# Altium project WSN_Node.PrjPcb
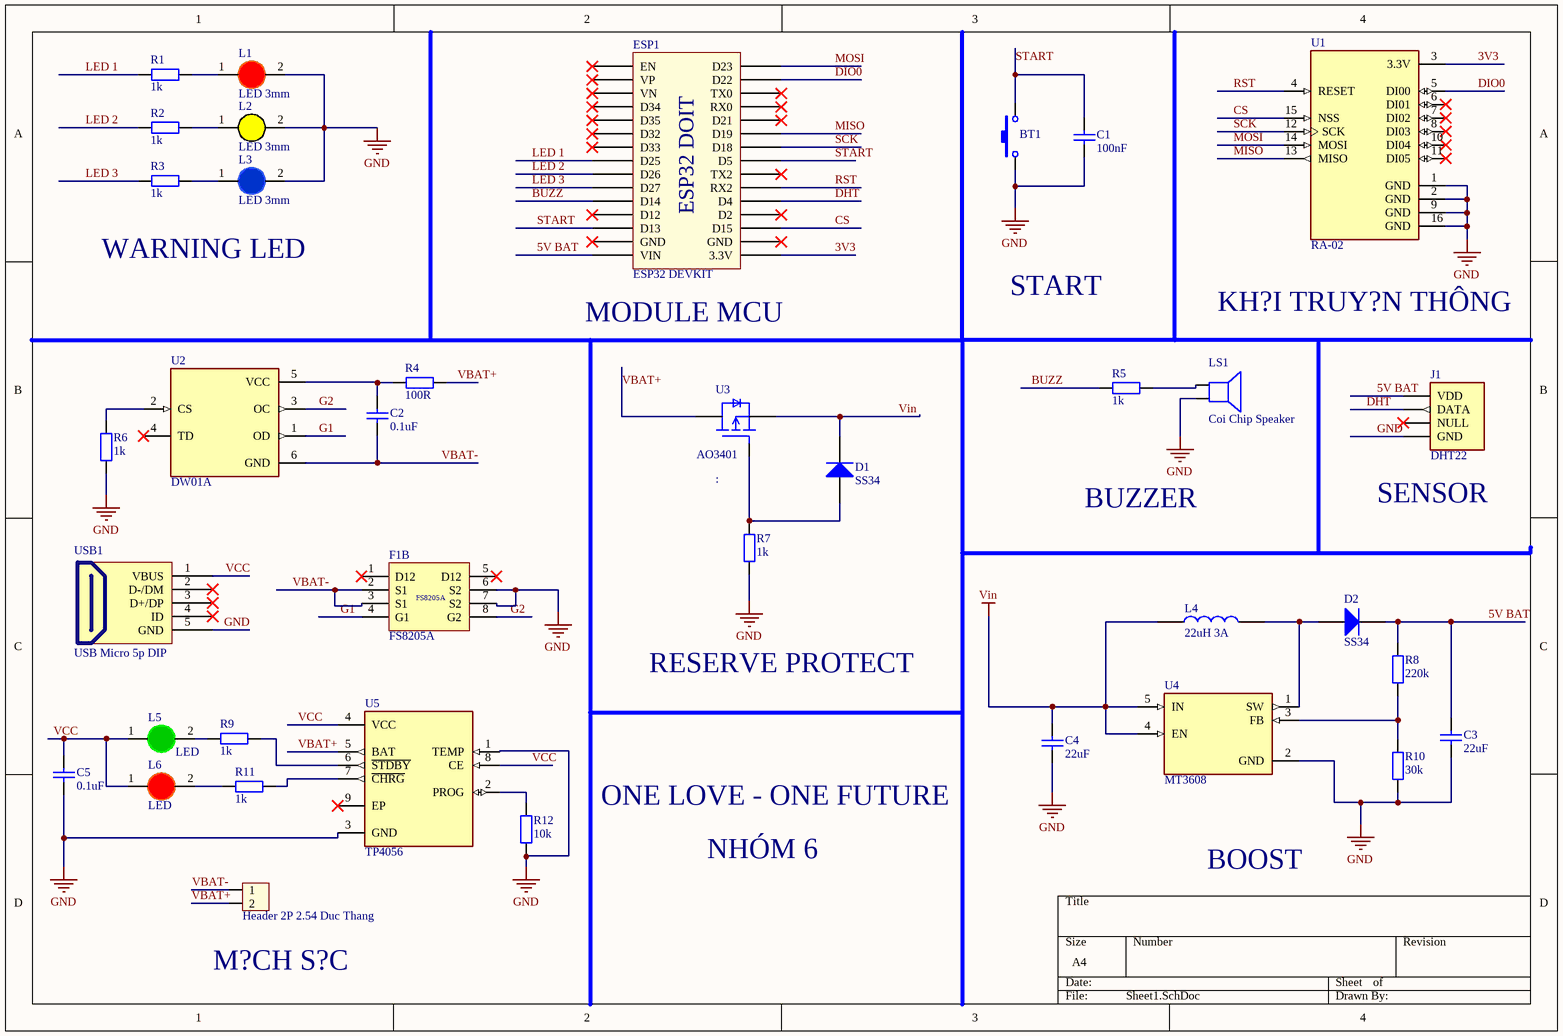
[diagram p0: Sheet1.SchDoc]
1 sheet, 37 parts. Net scope: global (net labels, ports and power ports of the same name join across sheets).
Board file: PCB2.PcbDoc

## Sheet Sheet1.SchDoc
size A4; SheetNumber: 1; SheetTotal: 1

### Parts
BT1  Nut Nhan 2 Chan SMD 3x6x2.5  [Nut Nhan 2 Chan SMD 3x6x2.5]  (value not drawn)
C1  100nF  [tu 0805]
C2  0.1uF  [tu 0805]
C3  22uF  [tu 0805]
C4  22uF  [tu 0805]
C5  0.1uF  [tu 0805]
D1  SS34  [DIODE SMA]
D2  SS34  [DIODE SMA]
ESP1  ESP32 DEVKIT  [ESP32 WROOM 32 KIT]
F1  FS8205A  [SOP65P640X120-8N]  (part B of 2)
H1  Header 2P 2.54 Duc Thang  [XH2.54M-2]
J1  DHT22  [DHT22]
L1  LED 3mm  [LED-3MM-RED]
L2  LED 3mm  [LED-3MM-YELLOW]
L3  LED 3mm  [LED-3MM-BLUE]
L4  22uH 3A  [CUON CAM 100uH3A]
L5  LED  [LED-3MM-GREEN]
L6  LED  [LED-3MM-RED]
LS1  Coi Chip Speaker  [Coi Chip Speacker]
R1  1k  [tro smd 0805]
R2  1k  [tro smd 0805]
R3  1k  [tro smd 0805]
R4  100R  [tro smd 0805]
R5  1k  [tro smd 0805]
R6  1k  [tro smd 0805]
R7  1k  [tro smd 0805]
R8  220k  [tro smd 0805]
R9  1k  [tro smd 0805]
R10  30k  [tro smd 0805]
R11  1k  [tro smd 0805]
R12  10k  [tro smd 0805]
U1  RA-02  [RA-02]
U2  DW01A  [SOT95P280X145-6N]
U3  AO3401  [SOT23-3]
U4  MT3608  [SOT95P280X145-6N]
U5  TP4056  [SOP127P600X175-9N]
USB1  USB Micro 5p DIP  [USB Micro 5p DIP]

### Nets
GND: BT1.1 C1.2 C3.2 C4.2 C5.2 F1.6(S2) F1.7(S2) J1.GND L1.2(K) L2.2(K) L3.2(K) LS1.2 R6.1 R7.1 R10.1 R12.1 U1.1(GND) U1.2(GND) U1.9(GND) U1.16(GND) U4.2(GND) U5.1(TEMP) U5.3(GND) USB1.5(GND)
Vin: C4.1 D1.2(K) L4.1 U3.2(S) U4.4(EN) U4.5(IN)
3V3: ESP1.16(3.3V) U1.3(3.3V)
5V BAT: C3.1 D2.2(K) ESP1.15(VIN) J1.VDD R8.2
BUZZ: ESP1.11(D14) R5.1
CS: ESP1.18(D15) U1.15(NSS)
DHT: ESP1.20(D4) J1.DATA
DIO0: ESP1.29(D22) U1.5(DI00)
G1: F1.4(G1) U2.1(OD)
G2: F1.8(G2) U2.3(OC)
LED 1: ESP1.8(D25) R1.1
LED 2: ESP1.9(D26) R2.1
LED 3: ESP1.10(D27) R3.1
MISO: ESP1.25(D19) U1.13(MISO)
MOSI: ESP1.30(D23) U1.14(MOSI)
RST: ESP1.21(RX2) U1.4(RESET)
SCK: ESP1.24(D18) U1.12(SCK)
START: BT1.2 C1.1 ESP1.13(D13) ESP1.23(D5)
VBAT+: H1.2 R4.2 U3.3(D) U5.5(BAT)
VBAT-: C2.2 F1.2(S1) F1.3(S1) H1.1 U2.6(GND)
VCC: C5.1 L5.1(A) L6.1(A) U5.4(VCC) U5.8(CE) USB1.1(VBUS)
NetC2_1: C2.1 R4.1 U2.5(VCC)
NetD1_1: D1.1(A) R7.2 U3.1(G)
NetD2_1: D2.1(A) L4.2 U4.1(SW)
NetL1_1: L1.1(A) R1.2
NetL2_1: L2.1(A) R2.2
NetL3_1: L3.1(A) R3.2
NetL5_2: L5.2(K) R9.1
NetL6_2: L6.2(K) R11.1
NetLS1_1: LS1.1 R5.2
NetR6_2: R6.2 U2.2(CS)
NetR8_1: R8.1 R10.2 U4.3(FB)
NetR9_2: R9.2 U5.6(~{STDBY})
NetR11_2: R11.2 U5.7(~{CHRG})
NetR12_2: R12.2 U5.2(PROG)

Not connected (* = marked no-connect by the designer): ESP1 1(EN)* 2(VP)* 3(VN)* 4(D34)* 5(D35)* 6(D32)* 7(D33)* 12(D12)* 14(GND)* 17(GND)* 19(D2)* 22(TX2)* 26(D21)* 27(RX0)* 28(TX0)*; F1 1(D12)* 5(D12)*; J1 NC(NULL)*; U1 6(DI01)* 7(DI02)* 8(DI03)* 10(DI04)* 11(DI05)*; U2 4(TD)*; U5 9(EP)*; USB1 2(D-/DM)* 3(D+/DP)* 4(ID)*

### Notes on the sheet
- WARNING LED
- START
- KH?I TRUY?N THÔNG
- (near ESP1) MODULE MCU
- BUZZER
- (near J1) SENSOR
- RESERVE PROTECT
- ONE LOVE - ONE FUTURE
- NHÓM 6
- BOOST
- (near H1) M?CH S?C
- (in symbol ESP32 WROOM 32 KIT) ESP32 DOIT

### Library data of the parts
BT1 = Nut Nhan 2 Chan SMD 3x6x2.5: Ma_Hang: MH001036; Ten: Nút Nh?n 2 Chân 3x6x2.5MM SMD
C1 = Tu 0805 220nF 50V 10%: Dán; Don_Vi: Con; So_Chan: 2; Ten_Linh_Kien: T? 0805 220nF 50V 10%; Ma_Hang: MH008099; Chung_Loai: Dán; Kieu_Chan: *
C2 C5 = Tu 0805 10pF 50V 10%: Dán; Don_Vi: Con; So_Chan: 2; Ten_Linh_Kien: T? 0805 10P 10% 50V; Ma_Hang: MH004554; Chung_Loai: Dán; Kieu_Chan: *
C3 C4 = Tu 0805 22nF 50V 20%: Dán; Don_Vi: Con; So_Chan: 2; Ten_Linh_Kien: T? 0805 22nF 50V 20%; Ma_Hang: MH007857; Chung_Loai: Dán; Kieu_Chan: *
D1 D2 = Diode SS34 ( 1N5822 ): Dán; Don_Vi: Con; Ma_Hang: MH002104; Ten_Linh_Kien: Diode SS34 3A 40V SMA ( 1N5822 SS34A); Kieu_Chan: *; Chung_Loai: Dán
ESP1 = ESP32 WROOM 32 KIT
H1 = Header 2P 2.54 Duc Thang: C?m; Ten_Linh_Kien: Header 2P XH2.54-2P Ð?c Th?ng; Don_Vi: Con; Ma_Hang: MH001283; Chung_Loai: C?m
J1 = DHT22: Capacitive-type humidity and temperature module/sensor; MF: Aosong Electronics; SnapEDA_Link: https://www.snapeda.com/parts/DHT22/Aosong+Electronics/view-part/?ref=snap; Package: Package; Value: *; MP: DHT22; Check_prices: https://www.snapeda.com/parts/DHT22/Aosong+Electronics/view-part/?ref=eda
L1 L6 = LED 3mm Do: C?m; Don_Vi: Con; Ma_Hang: MH003892; Ten_Linh_Kien: Led 3MM Ph? Ð? (10c); Ghi_Chu: *; Kieu_Chan: *; Chung_Loai: C?m
L2 = LED 3mm Vang: C?m; Don_Vi: Con; Ma_Hang: MH003893; Ten_Linh_Kien: Led 3MM Ph? Vàng (10c); Ghi_Chu: *; Kieu_Chan: *; Chung_Loai: C?m
L3 = LED 3mm Xanh Duong: C?m; Don_Vi: Con; Ma_Hang: MH009003; Ten_Linh_Kien: LED 3MM Xanh Duong SS (1000c); Ghi_Chu: *; Kieu_Chan: *; Chung_Loai: C?m
L4 = CUON CAM 100uH DIP: Dán; Don_Vi: Con; Ma_Hang: MH002209; Ten_Linh_Kien: Cu?n C?m 100uH 3A 8x10MM; Chung_Loai: Dán; Ghi Chu: *; Kieu Chan: *
L5 = LED 3mm Xanh La: C?m; Don_Vi: Con; Ma_Hang: MH001054; Ten_Linh_Kien: Led 3MM Ph? Xanh (10c); Ghi_Chu: *; Kieu_Chan: *; Chung_Loai: C?m
LS1 = Coi Chip Speaker: Còi chip
R1-R3 R5-R7 R9 R11 = Tro 0805 1% 1k: Dán; Don_Vi: Con; So_Chan: 2; Ten_Linh_Kien: Tr? 0805 1% 1k; Ma_Hang: MH005468; Chung_Loai: Dán; Kieu_Chan: *
R4 = Tro 0805 5% 100R: Dán; Don_Vi: Con; So_Chan: 2; Ten_Linh_Kien: Tr? 0805 5% 100R; Ma_Hang: MH005251; Chung_Loai: Dán; Kieu_Chan: *
R8 = Tro 0805 1% 220k: Dán; Don_Vi: Con; So_Chan: 2; Ten_Linh_Kien: Tr? 0805 1% 220k; Ma_Hang: MH005484; Chung_Loai: Dán; Kieu_Chan: *
R10 = Tro 0805 5% 30k: Dán; Don_Vi: Con; So_Chan: 2; Ten_Linh_Kien: Tr? 0805 5% 30k; Ma_Hang: MH005314; Chung_Loai: Dán; Kieu_Chan: *
R12 = Tro 0805 1% 10k: Dán; Don_Vi: Con; So_Chan: 2; Ten_Linh_Kien: Tr? 0805 1% 10k; Ma_Hang: MH005473; Chung_Loai: Dán; Kieu_Chan: *
U1 = RA-02: General ISM < 1GHz LoRa™ Transceiver Module 410MHz ~ 525MHz Antenna Not Included, I-PEX Surface Mount; MF: Ai-Thinker; Package: None; Price: None; Value: *; SnapEDA_Link: https://www.snapeda.com/parts/RA-02/AI-Thinker/view-part/?ref=snap; MP: RA-02; Availability: Not in stock; Check_prices: https://www.snapeda.com/parts/RA-02/AI-Thinker/view-part/?ref=eda
U2 = DW01A: One Cell Lithium-ion/Polymer Battery Protection IC; MF: Fortune Semiconductor; SnapEDA_Link: https://www.snapeda.com/parts/DW01A/Fortune+Semiconductor/view-part/?ref=snap; Package: SOT-23-6 Fortune Semiconductor; Value: *; MP: DW01A; Check_prices: https://www.snapeda.com/parts/DW01A/Fortune+Semiconductor/view-part/?ref=eda
U3 = AO3401: P-Channel 30V 4A (Ta) 1.4W (Ta) Surface Mount SOT-23-3L; MF: Alpha & Omega Semiconductor; Price: None; SnapEDA_Link: https://www.snapeda.com/parts/AO3401/Alpha%20&%20Omega%20Semiconductor/view-part/4795619/?ref=snap; Arrow_Electronics-Purchase-URL: https://snapeda.com/shop?store=Arrow+Electronics&id=4795619; Availability: Warning; MP: AO3401; Value: *; Package: SOT-23-3 Alpha &amp; Omega Semiconductor
U4 = MT3608: High Efficiency 1.2MHz2A Step Up Converter; MF: Aerosemi Technology Co., Ltd; Price: None; Availability: Not in stock; Package: Package; MP: MT3608; Value: *; SnapEDA_Link: https://www.snapeda.com/parts/MT3608/Aerosemi+Technology+Co.%252C+Ltd/view-part/?ref=snap; Check_prices: https://www.snapeda.com/parts/MT3608/Aerosemi+Technology+Co.%252C+Ltd/view-part/?ref=eda
U5 = TP4056: Complete single cell Li-Ion battery with a constant current / constant voltage linear charger; MF: NanJing Top Power ASIC Corp.; Check_prices: https://www.snapeda.com/parts/TP4056/NanJing+Top+Power+ASIC+Corp./view-part/?ref=eda; SnapEDA_Link: https://www.snapeda.com/parts/TP4056/NanJing+Top+Power+ASIC+Corp./view-part/?ref=snap; Price: None; Availability: Not in stock; Package: Package; MP: TP4056; Value: *
USB1 = USB Micro 5p DIP: USB Type B; Ten: MicroUSB MK5P DIP; Ma_Hang: MH005145